# EAGLE design Controler 2_25 (EAGLE 9.0.0)
CNAME: Franks FlightSim Boards; CPROJECT: Franks FlightSim Boards; CREVISION: v1.1; DESIGNER: Frank van Ierland
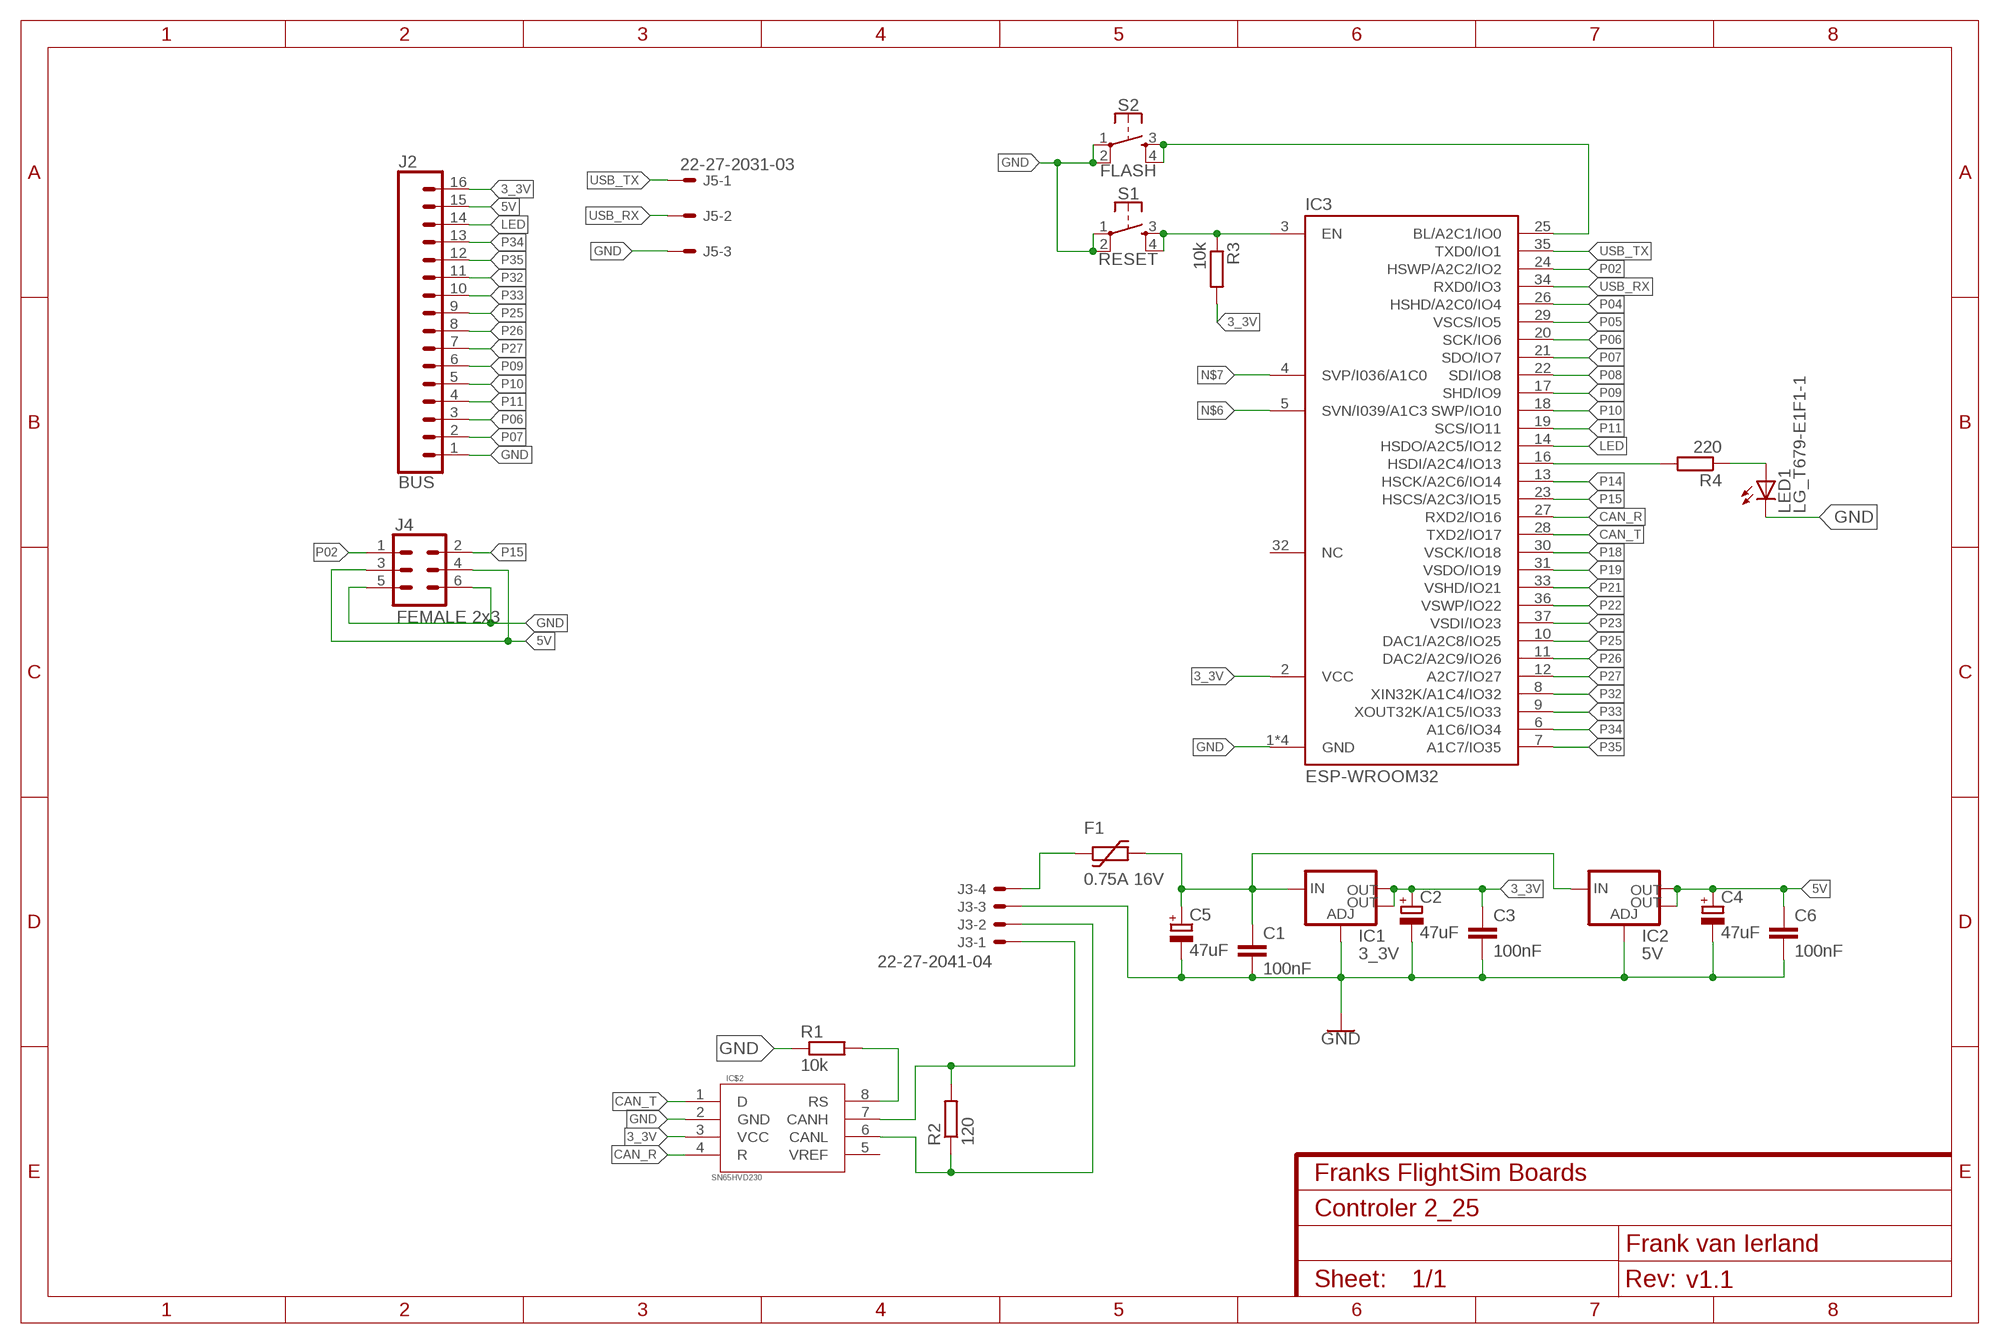
[diagram p0: schematic, sheet 1]

## Parts
C1  100nF  C-EUC1206  [C1206]
C2  47uF  CPOL-EUCT3528  [CT3528]
C3  100nF  C-EUC1206  [C1206]
C4  47uF  CPOL-EUCT3528  [CT3528]
C5  47uF  CPOL-EU153CLV-0605  [153CLV-0605]
C6  100nF  C-EUC1206  [C1206]
F1  0.75A 16V  1812L  [1812L]
IC1  3_3V  V_REG_LM1117SOT223  [SOT223]
IC2  5V  V_REG_LM1117SOT223  [SOT223]
IC3  ESP-WROOM32  [ESP-WROOM32]
IC$2  SN65HVD230  [SO08]
J2  BUS  CONN_16  [1X16]
J3  22-27-2041-04  [6410-04]
J4  FEMALE 2x3  CONN_03X2FEMALE  [2X3]
J5  22-27-2031-03  [6410-03]
LED1  LG_T679-E1F1-1  [PLCC2]
R1  10k  R-EU_M1206  [M1206]
R2  120  R-EU_R1210  [R1210]
R3  10k  R-EU_M1206  [M1206]
R4  220  R-EU_M1206  [M1206]
S1  RESET  MOMENTARY-SWITCH-SPST-2-SMD-4.6X2.8MM  [TACTILE_SWITCH_SMD_4.6X2.8MM]
S2  FLASH  MOMENTARY-SWITCH-SPST-2-SMD-4.6X2.8MM  [TACTILE_SWITCH_SMD_4.6X2.8MM]

## Nets
3_3V [3_3V]: C2.-(+) C3.1 IC1.2(OUT) IC1.4(OUT) IC3.2(VCC) IC$2.3(VCC) J2.16 R3.2
5V [5V]: C4.-(+) C6.1 IC2.2(OUT) IC2.4(OUT) J2.15 J4.3 J4.4
12V [12V]: C1.1 C5.+ F1.2 IC1.3(IN) IC2.3(IN)
CAN_R: IC3.27(RXD2/IO16) IC$2.4(R)
CAN_T: IC3.28(TXD2/IO17) IC$2.1(D)
GND [GND]: C1.2 C2.+(-) C3.2 C4.+(-) C5.- C6.2 IC1.1(ADJ) IC2.1(ADJ) IC3.1(GND) IC3.15(GND) IC3.38(GND) IC3.TP(GND) IC$2.2(GND) J2.1 J3.3 J4.5 J4.6 J5.3 LED1.C R1.1 S1.1 S1.2 S2.1 S2.2
LED [LED]: IC3.14(HSDO/A2C5/IO12) J2.14
N$1: IC$2.8(RS) R1.2
N$2: IC$2.7(CANH) J3.1 R2.2
N$3: IC$2.6(CANL) J3.2 R2.1
N$4: LED1.A R4.1
N$5: F1.1 J3.4
N$6: IC3.5(SVN/I039/A1C3)
N$7: IC3.4(SVP/I036/A1C0)
P00: IC3.25(BL/A2C1/IO0) S2.3 S2.4
P02: IC3.24(HSWP/A2C2/IO2) J4.1
P04: IC3.26(HSHD/A2C0/IO4)
P05: IC3.29(VSCS/IO5)
P06: IC3.20(SCK/IO6) J2.3
P07: IC3.21(SDO/IO7) J2.2
P08: IC3.22(SDI/IO8)
P09: IC3.17(SHD/IO9) J2.6
P10: IC3.18(SWP/IO10) J2.5
P11: IC3.19(SCS/IO11) J2.4
P13: IC3.16(HSDI/A2C4/IO13) R4.2
P14: IC3.13(HSCK/A2C6/IO14)
P15: IC3.23(HSCS/A2C3/IO15) J4.2
P18: IC3.30(VSCK/IO18)
P19: IC3.31(VSDO/IO19)
P21: IC3.33(VSHD/IO21)
P22: IC3.36(VSWP/IO22)
P23: IC3.37(VSDI/IO23)
P25: IC3.10(DAC1/A2C8/IO25) J2.9
P26: IC3.11(DAC2/A2C9/IO26) J2.8
P27: IC3.12(A2C7/IO27) J2.7
P32: IC3.8(XIN32K/A1C4/IO32) J2.11
P33: IC3.9(XOUT32K/A1C5/IO33) J2.10
P34: IC3.6(A1C6/IO34) J2.13
P35: IC3.7(A1C7/IO35) J2.12
RESET: IC3.3(EN) R3.1 S1.3 S1.4
USB_RX: IC3.34(RXD0/IO3) J5.2
USB_TX: IC3.35(TXD0/IO1) J5.1
Unconnected: IC3.32(NC) IC$2.5(VREF)

## Library data of the parts
C1 C3 C6 = resistor:C-EU: CAPACITOR, European symbol
C2 C4 C5 = resistor:CPOL-EU: POLARIZED CAPACITOR, European symbol
F1 = fuses:1812L: FUSE
IC1 IC2 = SparkFun-IC-Power:V_REG_LM1117: Voltage Regulator LM1117 Standard adjustable voltage regulator but in SMD form. Spark Fun Electronics SKU : COM-00595; PROD_ID: VREG-08170
IC3 = Franks:ESP-WROOM32: Espressif ESP-WROOM-32 ESP32 WiFi/WLAN + Bluetooth/BLE Module Compatible with AI-Thinker ESP-32S Module.
IC$2 = Franks:SN65HVD230
J2 = SparkFun-Connectors:CONN_16: Multi connection point. Often used as Generic Header-pin footprint for 0.1 inch spaced/style header connections On any of the 0.1 inch spaced packages, you can populate with these: Break Away Headers - Straight <https://www.sparkfun.com/products/116> (PRT-00116) Break Away Male Headers - Right Angle <https://www.sparkfun.com/products/553> (PRT-00553) Female Headers <https://www.sparkfun.com/products/115> (PRT-00115) Break Away Headers - Machine Pin <https://www.sparkfun.com/products/117> (PRT-00117) Break Away Female Headers - Swiss Machine Pin <https://www.sparkfun.com/products/743> (PRT-00743) For SCREWTERMINALS and SPRING TERMINALS visit here: Screw Terimnals on SparkFun.com <https://www.sparkfun.com/search/results?term=Screw+Terminals> (5mm/3.5mm/2.54mm spacing) This device is also useful as a general connection point to wire up your design to another part of your project. Our various solder wires solder well into these plated through hole pads. Hook-Up Wire - Assortment (Stranded, 22 AWG) <https://www.sparkfun.com/products/11375> (PRT-11375) Hook-Up Wire - Assortment (Solid Core, 22 AWG) <https://www.sparkfun.com/products/11367> (PRT-11367) View the entire wire category on our website here <https://www.sparkfun.com/categories/141> Special notes: Molex polarized connector foot print use with SKU : PRT-08231 with associated crimp pins and housings. 1MM SMD Version SKU: PRT-10208 NOTES ON THE VARIANTS LOCK and LOCK_LONGPADS... This footprint was designed to help hold the alignment of a through-hole component (i.e. 6-pin header) while soldering it into place. You may notice that each hole has been shifted either up or down by 0.005 of an inch from it's more standard position (which is a perfectly straight line). This slight alteration caused the pins (the squares in the middle) to touch the edges of the holes. Because they are alternating, it causes a "brace" to hold the component in place. 0.005 has proven to be the perfect amount of "off-center" position when using our standard breakaway headers. Although looks a little odd when you look at the bare footprint, once you have a header in there, the alteration is very hard to notice. Also,if you push a header all the way into place, it is covered up entirely on the bottom side.
J3 = con-molex:22-?-04: CONNECTOR wire to board 2.54 mm (.1 inch) pitch header; MF: MOLEX; OC_FARNELL: unknown; OC_NEWARK: unknown
J4 = SparkFun-Connectors:CONN_03X2: Multi connection point. Often used as Generic Header-pin footprint for 0.1 inch spaced/style header connections You can populate with any combo of single row headers, but if you'd like an exact match, check these: Header - 2x3 (Male, 0.1") <https://www.sparkfun.com/products/12807> (PRT-12807) Header - 2x3 (Female, 0.1") <https://www.sparkfun.com/products/13010> (PRT-13010) 2x3 Pin Shrouded Header <https://www.sparkfun.com/products/10877> (PRT-10877) On any of the 0.1 inch spaced packages, you can populate with these: Break Away Headers - Straight <https://www.sparkfun.com/products/116> (PRT-00116) Break Away Male Headers - Right Angle <https://www.sparkfun.com/products/553> (PRT-00553) Female Headers <https://www.sparkfun.com/products/115> (PRT-00115) Break Away Headers - Machine Pin <https://www.sparkfun.com/products/117> (PRT-00117) Break Away Female Headers - Swiss Machine Pin <https://www.sparkfun.com/products/743> (PRT-00743) Special note: the shrouded connector mates well with our 3x2 ribbon cables: Ribbon Crimp Connector - 6-pin (2x3, Female) <https://www.sparkfun.com/products/10651> (PRT-10651) Ribbon Cable - 6 wire (15ft) <https://www.sparkfun.com/products/10646> (PRT-10646); PROD_ID: CONN-11566
J5 = con-molex:22-?-03: CONNECTOR wire to board 2.54 mm (.1 inch) pitch header; MF: MOLEX; OC_FARNELL: unknown; OC_NEWARK: unknown
LED1 = led:*_T679-?-1: LC TOPLED® Low Current LED Source: http://catalog.osram-os.com .. LG_LS_LY_T679_OBS.pdf; COLOR: green
R1-R4 = resistor:R-EU_: RESISTOR, European symbol
S1 S2 = SparkFun-Switches:MOMENTARY-SWITCH-SPST-2: Momentary Switch (Pushbutton) - SPST - Two Circuits Normally-open (NO) SPST momentary switches (buttons, pushbuttons). Schematic symbol includes two switch circuits. Variants SMD-4.6MMX2.8MM - 4.60mm x 2.80mm Tactile Momentary Button Switch - Used on SparkFun SAMD21 Mini Breakout <https://www.sparkfun.com/products/13664> SMD-5.2MM - Mini Pushbutton Switch - SMD <https://www.sparkfun.com/products/8720> - Used on Arduino Pro Mini <https://www.sparkfun.com/products/11114>; PROD_ID: SWCH-13065

## Net classes
1 GND: width 0.508 mm
2 12V: width 0.762 mm
3 3_3V: width 0.508 mm
4 5V: width 0.508 mm
5 LED: width 0.254 mm

## Board
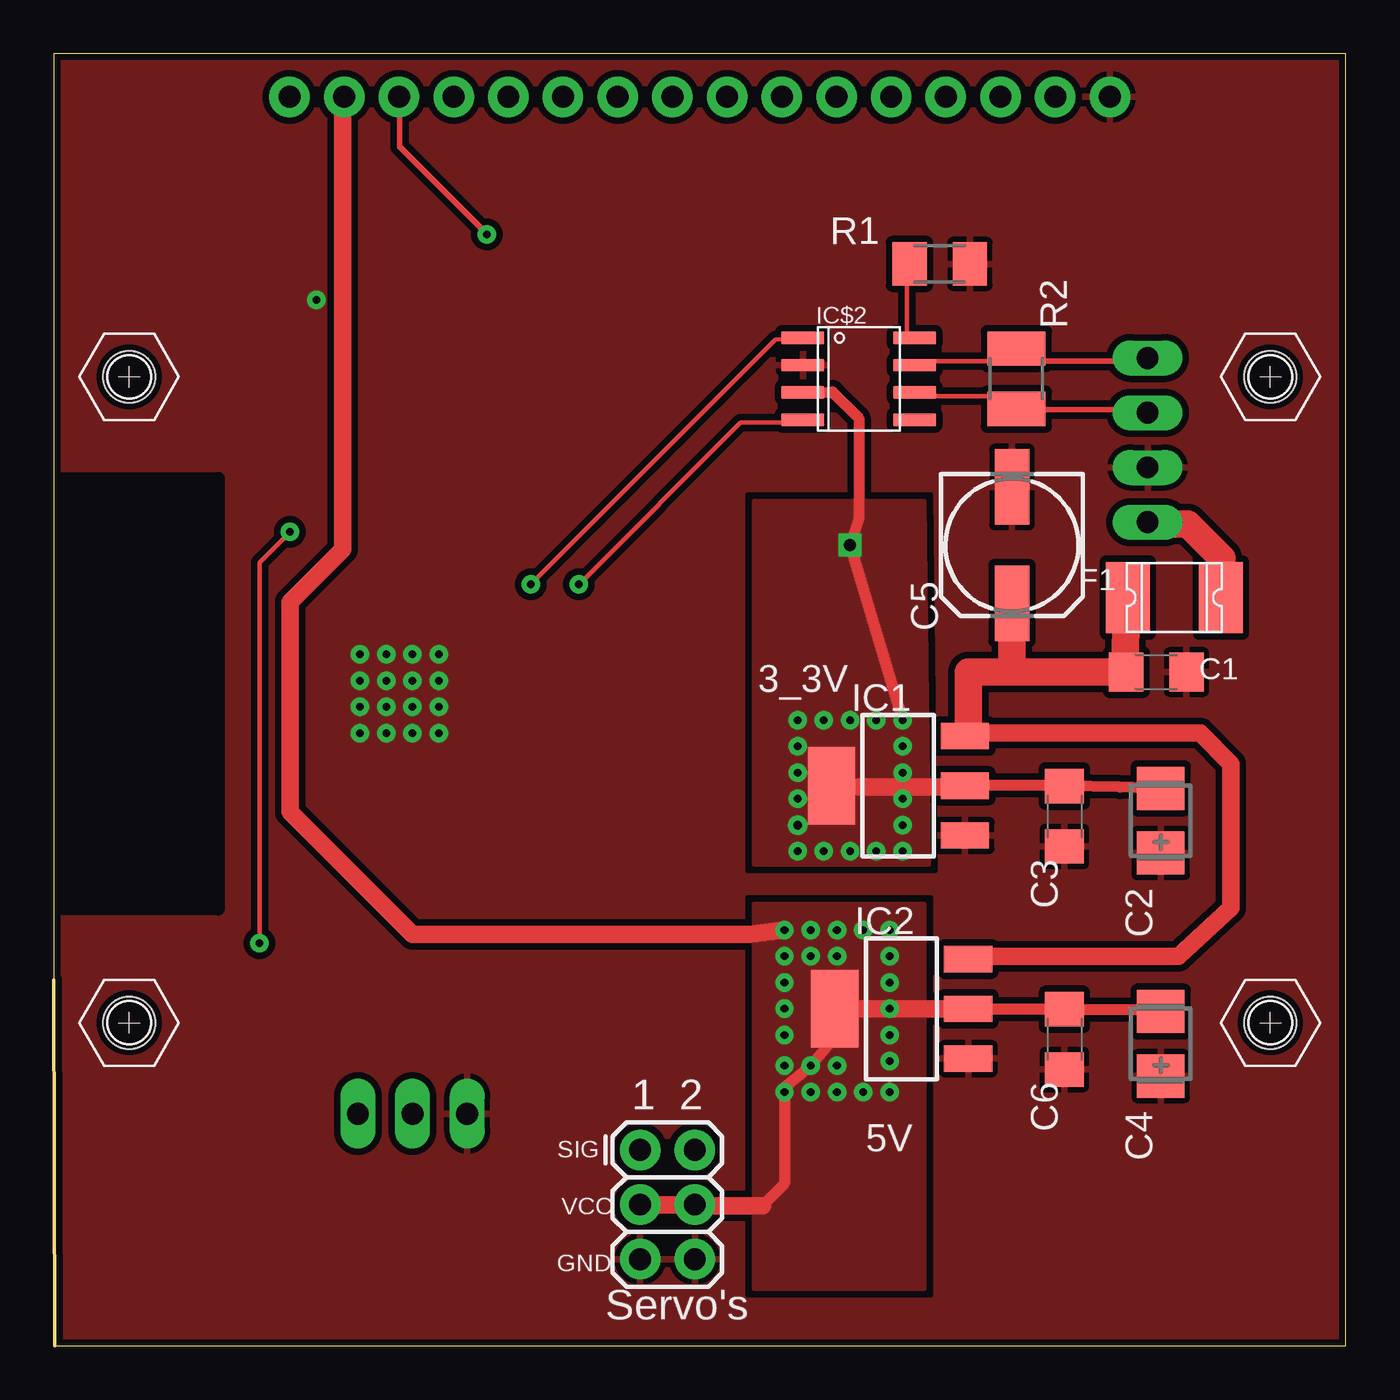
[diagram p1: board, top side]
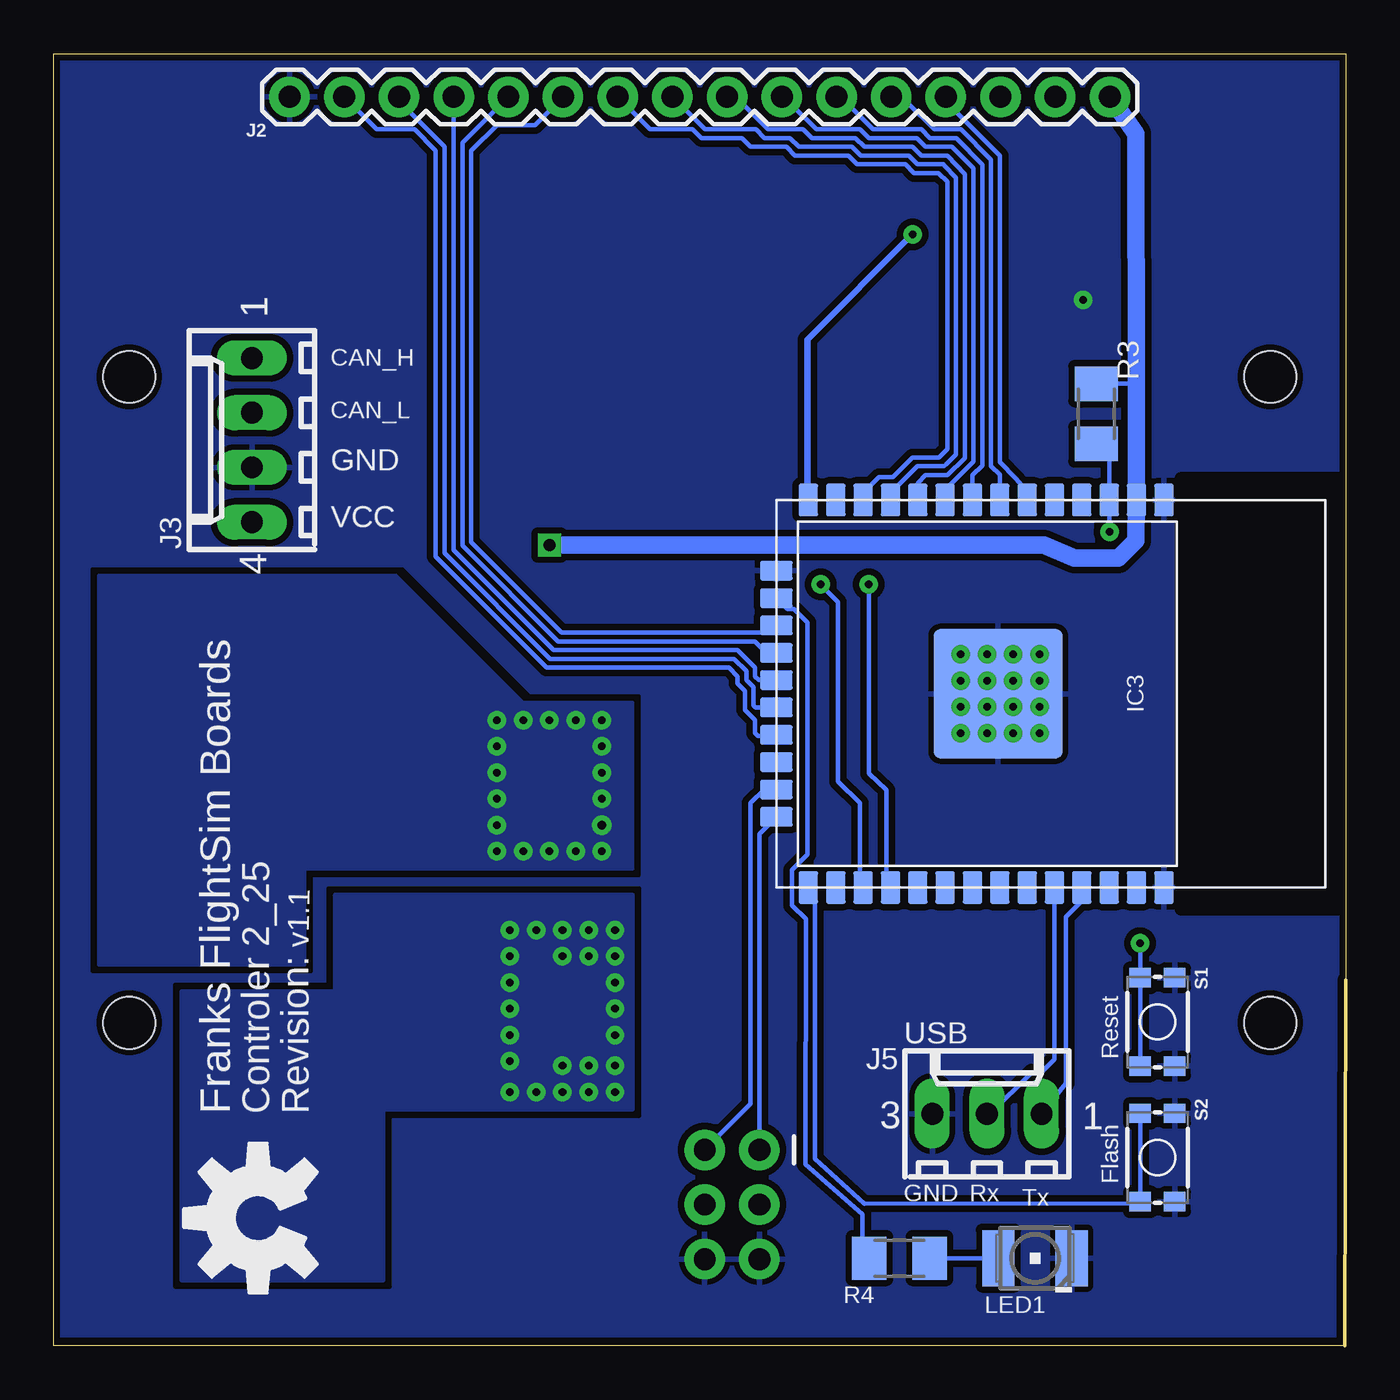
[diagram p2: board, bottom side, seen from below]

Size 60 x 60 mm. Coordinates in mm from the lower left corner, seen from the top.
Outline: 0,17 0.04,0
Outline: 0,0 60,0 60,60 0,60 0,0
Copper layers (1*16): Top 0.035mm / dielectric 1.5mm / Bottom 0.035mm
Design rules "SparkFun": minimum track width 8mil, minimum drill 20mil, track to track 8mil, track to pad 8mil, pad to pad 8mil, via to via 8mil, smd to smd 8mil, copper to edge 10mil, drill to drill 8mil, minimum pad ring 12mil, minimum via ring 10mil, stop-mask expansion 4mil, vias tented up to drill 25mil, thermal gap 10mil

### Footprints (pad centres in the part's own frame; a part is rotated, then mirrored left to right if it is on the bottom)
C1206 = smd 1.6 x 1.8: 1 -1.4,0; 2 1.4,0
CT3528 = smd 2 x 2.2: + -1.5,0; - 1.5,0
153CLV-0605 = smd 3.5 x 1.6: + 2.7,0; - -2.7,0
1812L = smd 2.03 x 3.3: 1 -2.16,0; 2 2.16,0
SOT223 = smd 1.219 x 2.235: 1 -2.311,-3.099; 2 0,-3.099; 3 2.311,-3.099 | smd 3.6 x 2.2: 4 0,3.099
ESP-WROOM32 = smd 1.5 x 0.9: 1 -9,7; 2 -9,5.73; 3 -9,4.46; 4 -9,3.19; 5 -9,1.92; 6 -9,0.65; 7 -9,-0.62; 8 -9,-1.89; 9 -9,-3.16; 10 -9,-4.43; 11 -9,-5.7; 12 -9,-6.97; 13 -9,-8.24; 14 -9,-9.51; 25 9,-9.51; 26 9,-8.24; 27 9,-6.97; 28 9,-5.7; 29 9,-4.43; 30 9,-3.16; 31 9,-1.89; 32 9,-0.62; 33 9,0.65; 34 9,1.92; 35 9,3.19; 36 9,4.46; 37 9,5.73; 38 9,7 | smd 0.9 x 1.5: 15 -5.715,-11; 16 -4.445,-11; 17 -3.175,-11; 18 -1.905,-11; 19 -0.635,-11; 20 0.635,-11; 21 1.905,-11; 22 3.175,-11; 23 4.445,-11; 24 5.715,-11 | smd 6 x 6: TP 0,-0.7
SO08 = smd 2 x 0.6: 1 -2.6,1.905; 2 -2.6,0.635; 3 -2.6,-0.635; 4 -2.6,-1.905; 5 2.6,-1.905; 6 2.6,-0.635; 7 2.6,0.635; 8 2.6,1.905
1X16 = drill 1.016 pad 1.88: 1 0,0; 2 2.54,0; 3 5.08,0; 4 7.62,0; 5 10.16,0; 6 12.7,0; 7 15.24,0; 8 17.78,0; 9 20.32,0; 10 22.86,0; 11 25.4,0; 12 27.94,0; 13 30.48,0; 14 33.02,0; 15 35.56,0; 16 38.1,0
6410-04 = drill 1.016 long: 1 3.81,0; 2 1.27,0; 3 -1.27,0; 4 -3.81,0
2X3 = drill 1.016 pad 1.88: 1 0,0; 2 0,2.54; 3 2.54,0; 4 2.54,2.54; 5 5.08,0; 6 5.08,2.54
6410-03 = drill 1.016 long: 1 2.54,0; 2 0,0; 3 -2.54,0
PLCC2 = smd 2.6 x 1.5: A 0,1.7; C 0,-1.7
M1206 = smd 1.6 x 2: 1 -1.4,0; 2 1.4,0
R1210 = smd 1.6 x 2.7: 1 -1.4,0; 2 1.4,0
TACTILE_SWITCH_SMD_4.6X2.8MM = smd 0.9 x 1: 1 -2.05,-0.8; 2 2.05,-0.8; 3 2.05,0.8; 4 -2.05,0.8
M2.0_SW4.0_HOLE = hole 2.4: 0,0

### Placement (x,y rotation side)
C1  51.21,31.29 0 top
C2  51.41,24.38 90 top
C3  46.94,24.59 270 top
C4  51.41,14.02 90 top
C5  44.5,37.19 270 top
C6  46.94,14.22 270 top
F1  52.04,34.75 180 top
IC1  39.22,26.01 90 top
IC2  39.37,15.65 90 top
IC3  15.44,30.28 270 bottom
IC$2  37.39,44.91 0 top
J2  49.05,58 0 bottom
J3  50.8,42.06 90 bottom
J4  27.23,9.09 270 top
J5  16.66,10.77 0 bottom
LED1  14.43,4.06 90 bottom
R1  41.15,50.24 180 top
R2  44.7,44.91 90 top
R3  11.58,43.28 90 bottom
R4  20.73,4.06 180 bottom
S1  8.74,15.04 90 bottom
S2  8.74,8.74 90 bottom
U$1  [M2.0_SW4.0_HOLE]  3.5,45 0 top
U$2  [M2.0_SW4.0_HOLE]  3.5,15 0 top
U$3  [M2.0_SW4.0_HOLE]  56.5,15 0 top
U$4  [M2.0_SW4.0_HOLE]  56.5,45 0 top
U$10  [OSHW-LOGO-L]  50.51,5.92 90 bottom

### Tracks (layer width: path | path; a pad name or v marks a point on that pad's centre or on a via)
3_3V  (via drill 0.35, 0.4, 0.55)
  Top 0.508: 37.39,25.96 IC1.4 | C2.- 49.52,25.94 C3.1 46.67,26.01 IC1.2 41.55,25.96 | IC$2.3 36.17,44.3 37.39,43.08 37.39,38.41 v36.98,37.19 v39.42,29.06
  Top 0.813: 41.55,25.96 37.39,25.96
  Bottom 0.203: 9.55,37.37 9.55,38.91 IC3.2 | R3.2 9.75,44.68 9.73,44.7
  Bottom 0.813: J2.16 9.75,56.29 9.73,44.7 IC3.2 9.75,37.39 10.57,36.58 12.6,36.58 14.02,37.19 v36.98,37.19
  other vias: 35.76,22.96 34.54,24.18 36.98,22.96 38.2,22.96 34.54,22.96 39.42,22.96 39.42,27.84 34.54,25.4 34.54,26.62 34.54,27.84 39.42,26.62 39.42,25.4 34.54,29.06 35.76,29.06 36.98,29.06 38.2,29.06 39.42,24.18
  pour Top (isolate 0.254, no thermals): 40.64,22.35 32.51,22.35 32.51,39.22 40.44,39.22
  pour Bottom (no thermals): 33.12,22.15 33.12,29.87 38.2,29.87 44.09,35.76 57.91,35.76 57.91,17.68 48.36,17.68 48.36,22.15
5V  (via drill 0.35)
  Top 0.508: IC2.4 36.27,14.32 v35.15,13.01 33.93,11.99 v33.93,11.79 33.93,7.52 32.92,6.5 | 27.43,6.55 J4.3 | IC2.2 46.92,15.65 C6.1 51.31,15.62 C4.- | 30.23,6.55 30.28,6.5
  Top 0.813: 30.28,6.5 32.92,6.5 | 27.43,6.55 J4.4 30.23,6.55 | IC2.2 IC2.4 | J2.15 13.41,57.3 13.41,36.98 10.97,34.54 10.97,24.79 16.66,19.1 32.31,19.1 v33.93,19.3
  other vias: 38.81,11.79 37.59,11.79 36.37,11.79 35.15,11.79 36.37,13 33.93,13 33.93,14.43 33.93,15.65 33.93,16.87 33.93,18.08 35.15,18.08 36.37,18.08 36.37,19.3 35.15,19.3 37.59,19.3 38.81,19.3 38.81,18.08 38.81,16.87 38.81,15.65 38.81,14.43 38.81,13.21
  pour Top (no thermals): 40.44,2.64 32.51,2.64 32.51,20.52 40.44,20.52
  pour Bottom: 33.12,20.93 46.94,20.93 46.94,16.46 54.05,16.46 54.05,3.05 44.7,3.05 44.7,10.97 33.12,10.97
12V
  Top 0.508: IC2.3 43.36,17.96 43.48,18.09
  Top 0.813: 42.47,28.45 53.24,28.45 54.66,27.03 54.66,20.32 52.22,18.09 43.48,18.09
  Top 1.016: 42.47,28.45 IC1.3
  Top 1.27: C5.+ 44.5,31.29 | 44.5,31.29 42.47,31.29 42.47,28.45 | 44.5,31.29 C1.1 49.76,31.53 49.78,34.14 F1.2
CAN_R  (via drill 0.35)
  Top 0.203: IC$2.4 33.85,42.88 31.9,42.88 v24.38,35.36
  Bottom 0.203: v24.38,35.36 23.57,34.54 23.57,26.19 22.55,25.2 22.55,21.42 IC3.27
CAN_T  (via drill 0.35)
  Top 0.203: IC$2.1 33.53,46.74 v22.15,35.36
  Bottom 0.203: v22.15,35.36 22.15,26.57 21.34,25.81 21.34,21.49 IC3.28
GND  (via drill 0.35)
  other vias: 15.44,32.11 16.66,32.11 17.88,32.11 17.88,30.89 16.66,30.89 15.44,30.89 15.44,29.67 16.66,29.67 17.88,29.67 17.88,28.45 16.66,28.45 15.44,28.45 14.22,32.11 14.22,30.89 14.22,29.67 14.22,28.45 12.19,48.56
  pour Bottom (isolate 0.305, rank 2): 0,60 0.08,17.94 0,17.94 0,0.51 60,0.51 60,60
  pour Top (isolate 0.305, rank 2): 0.08,59.97 0.08,22.94 0,17 0,0 59.96,0 59.96,17.59 59.89,37.98 60,60
  pour Bottom: 10.77,48.97 10.97,53.04 15.24,53.04 15.24,47.35 10.77,47.35
LED  (via drill 0.35)
  Top 0.254: J2.14 16.05,57.1 16.05,55.68 v20.12,51.61
  Bottom 0.305: v20.12,51.61 24.99,46.74 24.99,39.32
  Bottom 0.508: 24.99,39.32 IC3.14
N$1
  Top 0.203: R1.2 39.62,49.99 39.62,46.94 IC$2.8
N$2
  Top 0.203: IC$2.7 40.44,45.72 43.89,45.72 44.12,45.74 44.14,45.74 R2.2 45.72,45.72 | 49.78,45.72 J3.1
  Top 0.254: 45.72,45.72 49.78,45.72
N$3
  Top 0.203: IC$2.6 40.23,44.3 40.44,44.09 43.48,44.09 43.51,44.12 44.05,44.12 R2.1 45.92,43.48 | J3.2 49.78,43.48
  Top 0.254: 49.78,43.48 45.92,43.48
N$4
  Bottom 0.203: LED1.A R4.1
N$5
  Top 1.016: 50.9,38.16 J3.4
  Top 1.27: F1.1 54.25,36.58 52.68,38.16 50.9,38.16
P00
  Bottom 0.203: IC3.25 24.64,20.76 24.64,8.67 22.35,6.58 10.06,6.6 S2.4 S2.3
P02
  Bottom 0.203: J4.1 27.23,23.78 IC3.24
P06
  Bottom 0.203: IC3.20 27.41,29.64 27.5,29.73 27.5,30.58 27.84,30.92 27.84,31.33 28.41,31.9 36.95,31.9 41.86,36.81 41.86,55.68 43.97,57.79 J2.3
P07
  Bottom 0.203: 26.75,28.06 26.49,28.32 | 26.49,28.32 IC3.21 | J2.2 45,56.49 43.25,56.49 42.27,55.51 42.27,36.65 37.12,31.5 28.65,31.5 28.25,31.09 28.25,30.75 27.9,30.41 27.9,29.52 27.43,29.05 27.43,28.45 27.31,28.32 26.49,28.32
P08
  Bottom 0.203: 26.96,26.79 IC3.22
P09
  Bottom 0.203: J2.6 37.66,56.69 39.42,56.69 40.62,55.5 40.62,37.33 36.41,33.12 26.77,33.12 IC3.17
P10
  Bottom 0.203: J2.5 41.02,55.87 41.02,37.16 36.58,32.72 27.43,32.72 26.82,32.11 26.52,32.11 IC3.18
P11
  Bottom 0.203: J2.4 41.43,36.96 36.78,32.31 28.25,32.31 27.43,31.5 27.43,31.09 27.25,30.91 IC3.19
P13
  Bottom 0.203: 22.37,3.47 22.17,3.82 R4.2 22.45,4.88 22.45,6.1 25.09,8.43 25.07,19.82 25.71,20.45 25.71,22.1 24.99,22.82 24.99,33.58 25.62,34.21 25.93,34.21 IC3.16
P15
  Bottom 0.203: J4.2 27.64,11.23 27.64,25.2 27,25.83 IC3.23
P25
  Bottom 0.203: J2.9 28.04,57.71 26.82,56.49 25.2,56.49 24.79,56.08 22.76,56.08 22.35,55.68 20.12,55.68 19.71,55.27 18.49,55.27 17.7,54.42 17.7,41.22 18.49,40.44 19.51,40.44 19.87,40.07 IC3.10
P26
  Bottom 0.203: J2.8 29.76,56.49 27.4,56.49 26.99,56.08 25.81,56.08 25.4,55.68 22.93,55.68 22.52,55.27 20.29,55.27 19.88,54.86 18.69,54.86 18.62,54.8 18.1,54.25 18.1,41.4 18.57,40.93 18.66,40.84 19.89,40.84 20.9,39.83 21.13,39.62 21.14,39.43 IC3.11
P27
  Bottom 0.203: J2.7 32.3,56.49 30.33,56.49 29.93,56.08 28.04,56.08 27.64,55.68 25.98,55.68 25.57,55.27 23.09,55.27 22.69,54.86 20.45,54.86 20.05,54.46 18.91,54.46 18.51,54.05 18.51,41.64 18.9,41.25 20.12,41.25 21.04,40.33 21.67,40.33 21.97,40.03 22.35,39.62 22.41,39.48 IC3.12
P32
  Bottom 0.203: J2.11 22.96,57.51 21.95,56.49 19.71,56.49 19.3,56.08 18.09,56.08 16.88,54.86 16.88,40.88 17.33,40.44 IC3.8
P33
  Bottom 0.203: J2.10 25.6,57.51 24.59,56.49 22.55,56.49 22.15,56.08 19.91,56.08 19.51,55.68 18.29,55.68 17.29,54.69 17.29,41.05 18.4,39.94 IC3.9
P34
  Bottom 0.203: J2.13 18.29,57.51 16.05,55.27 16.07,45.05 16.07,41.03 15.31,40.27 14.9,39.79 IC3.6
P35
  Bottom 0.203: J2.12 20.32,57.71 19.1,56.49 17.88,56.49 16.48,55.08 16.48,40.86 16.06,40.45 IC3.7
RESET  (via drill 0.35)
  Top 0.203: v9.55,18.69 9.55,36.37 v10.97,37.8
  Bottom 0.203: S1.4 S1.3 9.54,18.68 v9.55,18.69 | R3.1 10.98,41.28 IC3.3 10.98,37.81 v10.97,37.8
USB_RX
  Bottom 0.203: IC3.34 13.52,13.3 14.12,12.7 14.59,12.7 16.52,10.77 J5.2
USB_TX
  Bottom 0.203: IC3.35 12.19,20.73 13.01,19.91 13.01,12.19 J5.1

### Text on the board
bPlace: Reset | USB | Flash | Tx | Rx | GND
tNames: 1 2 | SIG | VCC | GND | Servo's
bNames: CAN_H | CAN_L | GND | VCC | Revision: